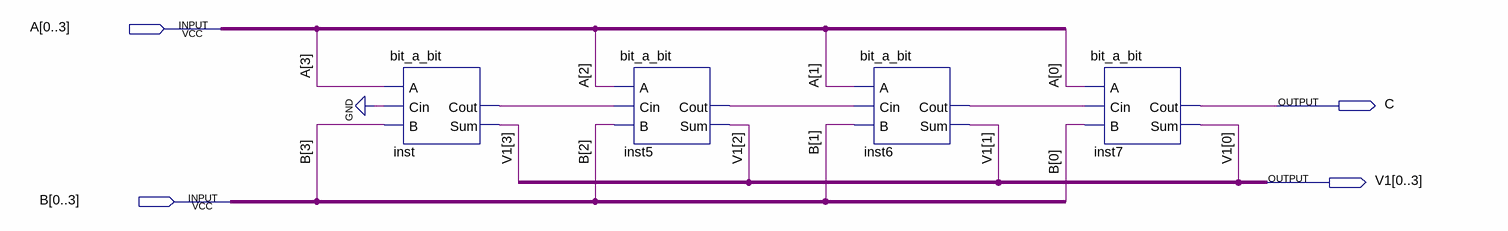
[diagram p0: schematic sheet]
// Quartus schematic FullAdder4bit.bdf as structural Verilog: 4 symbols, 4 pins
module FullAdder4bit (
  input  [0:3] A,
  input  [0:3] B,
  output C,
  output [0:3] V1
);

  wire inst5_cout, inst6_cout, inst_cout;

  bit_a_bit inst (.A(A[3]), .B(B[3]), .Cin(1'b0), .Sum(V1[3]), .Cout(inst_cout));
  bit_a_bit inst5 (.A(A[2]), .B(B[2]), .Cin(inst_cout), .Sum(V1[2]), .Cout(inst5_cout));
  bit_a_bit inst6 (.A(A[1]), .B(B[1]), .Cin(inst5_cout), .Sum(V1[1]), .Cout(inst6_cout));
  bit_a_bit inst7 (.A(A[0]), .B(B[0]), .Cin(inst6_cout), .Sum(V1[0]), .Cout(C));
endmodule
